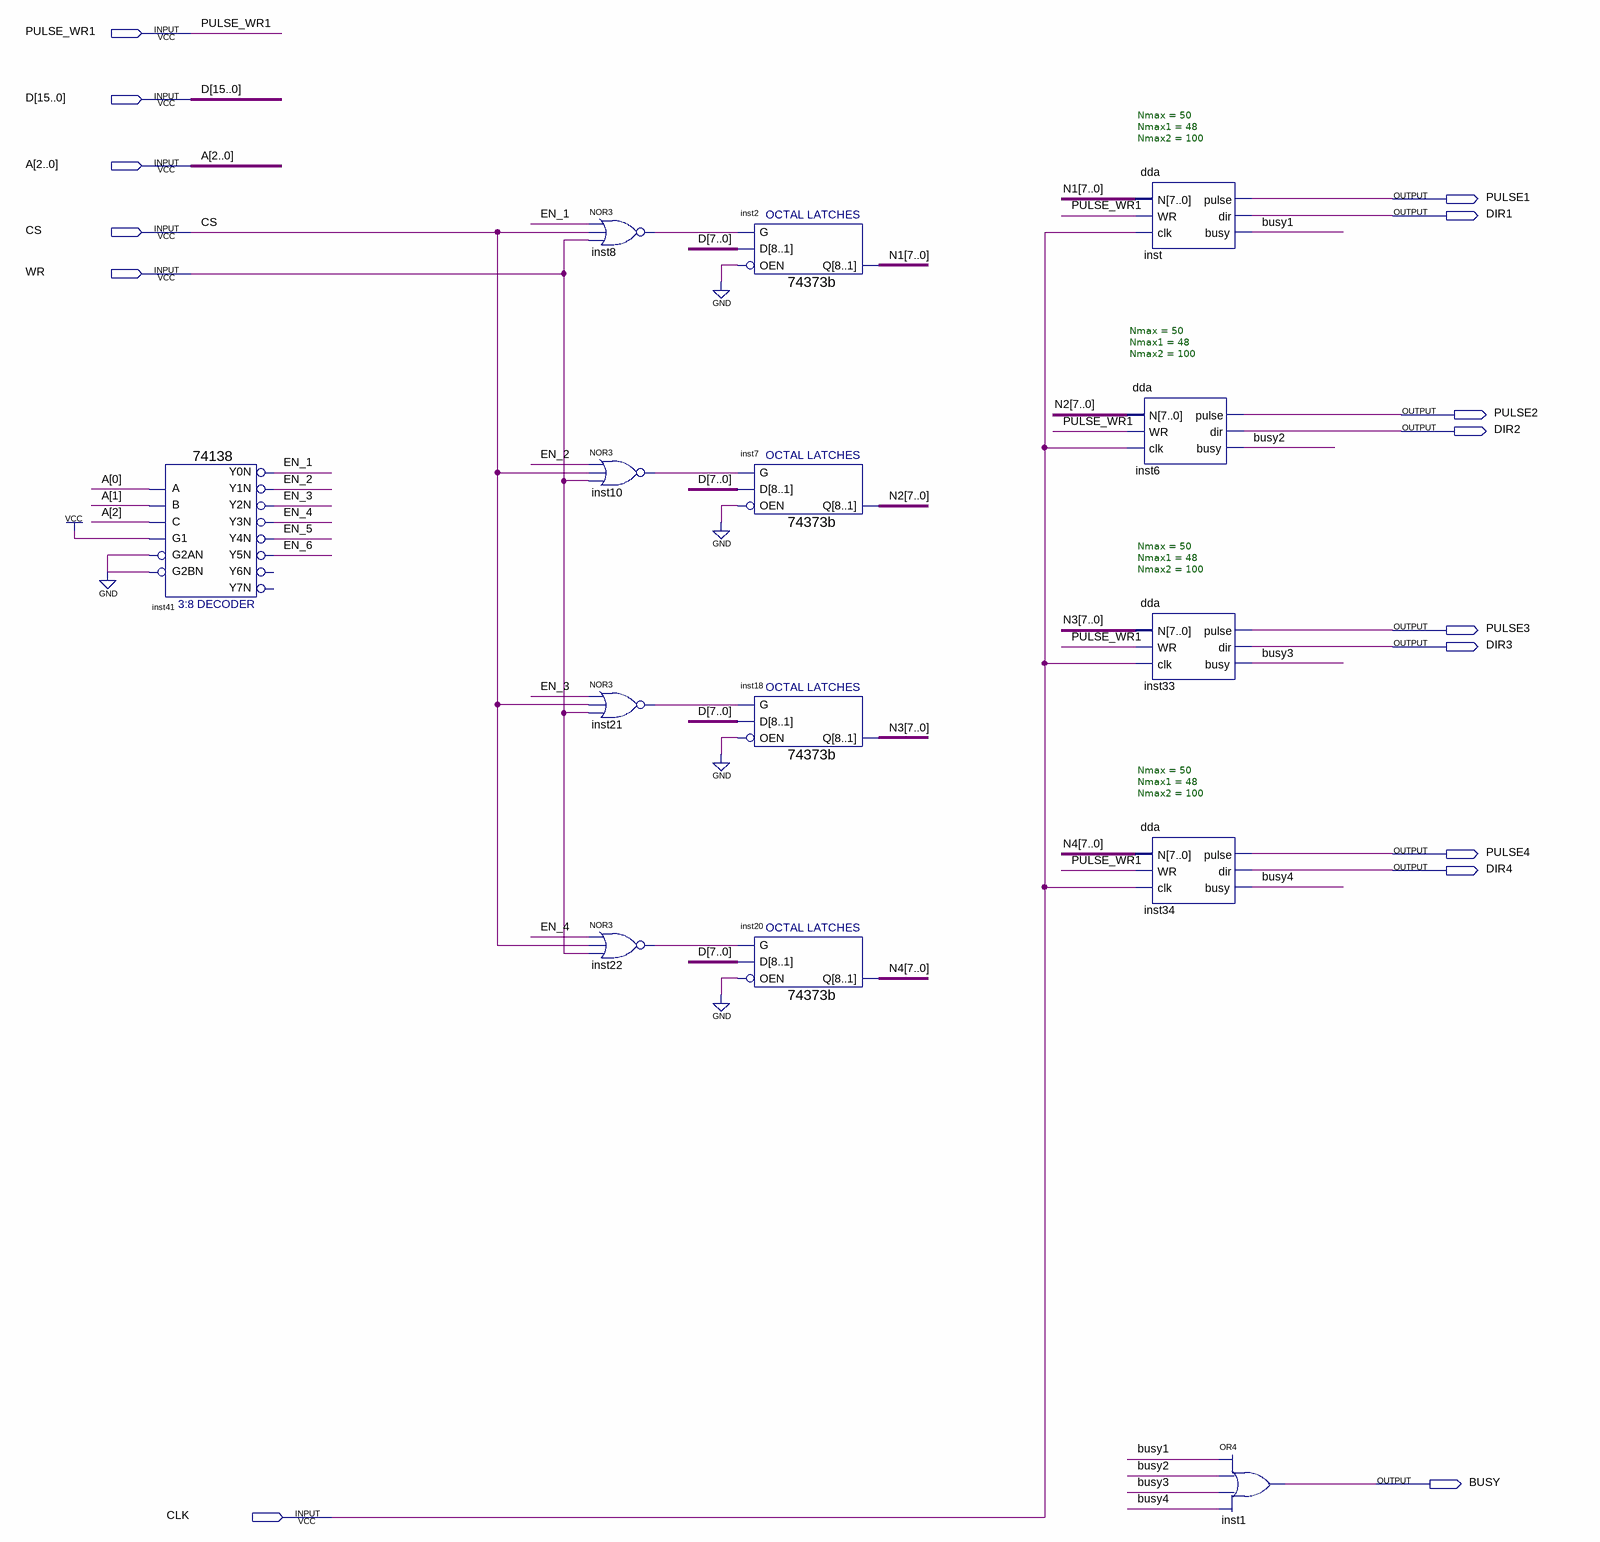
[diagram p0: schematic sheet]
// Quartus schematic dda_module.bdf as structural Verilog: 14 symbols, 15 pins
module dda_module (
  input  PULSE_WR1,
  input  [15:0] D,
  input  [2:0] A,
  input  CS,
  input  WR,
  input  CLK,
  output PULSE1,
  output DIR1,
  output PULSE2,
  output DIR2,
  output PULSE3,
  output DIR3,
  output PULSE4,
  output DIR4,
  output BUSY
);

  wire busy1, busy2, busy3, busy4, EN_1, EN_2, EN_3, EN_4, EN_5, EN_6, inst8_out, inst10_out, inst21_out,
       inst22_out;
  wire [7:0] N1, N2, N3, N4;

  \74138  inst41 (
    .A(A[0]), .B(A[1]), .G1(1'b1), .C(A[2]), .G2AN(1'b0), .G2BN(1'b0), .Y0N(EN_1), .Y1N(EN_2), .Y2N(EN_3),
    .Y3N(EN_4), .Y4N(EN_5), .Y5N(EN_6));  // open: Y6N, Y7N
  nor inst8 (inst8_out, EN_1, CS, WR);
  nor inst10 (inst10_out, EN_2, CS, WR);
  nor inst21 (inst21_out, EN_3, CS, WR);
  nor inst22 (inst22_out, EN_4, CS, WR);
  \74373b  inst2 (.D(D[7:0]), .G(inst8_out), .OEN(1'b0), .Q(N1));
  \74373b  inst7 (.D(D[7:0]), .G(inst10_out), .OEN(1'b0), .Q(N2));
  \74373b  inst18 (.D(D[7:0]), .G(inst21_out), .OEN(1'b0), .Q(N3));
  \74373b  inst20 (.D(D[7:0]), .G(inst22_out), .OEN(1'b0), .Q(N4));
  dda #(.Nmax(50), .Nmax1(48), .Nmax2(100)) inst (
    .N(N1), .WR(PULSE_WR1), .clk(CLK), .pulse(PULSE1), .dir(DIR1), .busy(busy1));
  dda #(.Nmax(50), .Nmax1(48), .Nmax2(100)) inst6 (
    .N(N2), .WR(PULSE_WR1), .clk(CLK), .pulse(PULSE2), .dir(DIR2), .busy(busy2));
  dda #(.Nmax(50), .Nmax1(48), .Nmax2(100)) inst33 (
    .N(N3), .WR(PULSE_WR1), .clk(CLK), .pulse(PULSE3), .dir(DIR3), .busy(busy3));
  dda #(.Nmax(50), .Nmax1(48), .Nmax2(100)) inst34 (
    .N(N4), .WR(PULSE_WR1), .clk(CLK), .pulse(PULSE4), .dir(DIR4), .busy(busy4));
  or inst1 (BUSY, busy1, busy2, busy3, busy4);
endmodule
